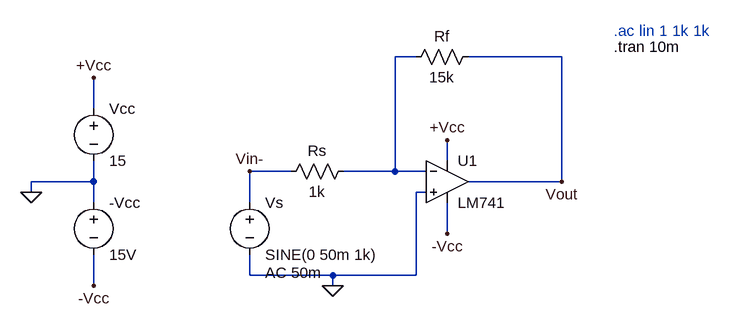
[diagram p0: schematic Inverting Mode.asc]
Inverting Mode.asc, the LTspice schematic file:
Version 4
SHEET 1 880 680
WIRE 144 -48 112 -48
WIRE 368 -48 224 -48
WIRE -352 32 -352 -16
WIRE 192 112 192 80
WIRE -48 128 -112 128
WIRE 112 128 112 -48
WIRE 112 128 32 128
WIRE 160 128 112 128
WIRE -352 144 -352 112
WIRE -352 144 -448 144
WIRE 368 144 368 -48
WIRE 368 144 224 144
WIRE -448 160 -448 144
WIRE 160 160 144 160
WIRE -352 176 -352 144
WIRE -112 176 -112 128
WIRE 192 224 192 176
WIRE -112 288 -112 256
WIRE 16 288 -112 288
WIRE 144 288 144 160
WIRE 144 288 16 288
WIRE -352 304 -352 256
WIRE 16 304 16 288
FLAG -448 160 0
FLAG -352 -16 +Vcc
FLAG 192 80 +Vcc
FLAG -352 304 -Vcc
FLAG 192 224 -Vcc
FLAG 16 304 0
FLAG 368 144 Vout
FLAG -112 128 Vin-
SYMBOL Opamps\\LM741 192 80 R0
SYMATTR InstName U1
SYMBOL res 240 -64 R90
WINDOW 0 0 56 VBottom 2
WINDOW 3 32 56 VTop 2
SYMATTR InstName Rf
SYMATTR Value 15k
SYMBOL res 48 112 R90
WINDOW 0 0 56 VBottom 2
WINDOW 3 32 56 VTop 2
SYMATTR InstName Rs
SYMATTR Value 1k
SYMBOL voltage -112 160 R0
WINDOW 123 24 124 Left 2
WINDOW 39 0 0 Left 0
SYMATTR Value2 AC 50m
SYMATTR InstName Vs
SYMATTR Value SINE(0 50m 1k)
SYMBOL voltage -352 16 R0
WINDOW 123 0 0 Left 0
WINDOW 39 0 0 Left 0
SYMATTR InstName Vcc
SYMATTR Value 15
SYMBOL voltage -352 160 R0
WINDOW 123 0 0 Left 0
WINDOW 39 0 0 Left 0
SYMATTR InstName -Vcc
SYMATTR Value 15V
TEXT 448 -88 Left 2 ;.ac lin 1 1k 1k
TEXT 448 -64 Left 2 !.tran 10m

The netlist it stands for:
* Inverting Mode.asc
XU1 0 N001 +Vcc -Vcc Vout LM741  ; pins In+ In- V+ V- OUT
Rf Vout N001 15k
Rs N001 Vin- 1k
Vs Vin- 0 SINE(0 50m 1k) AC 50m
Vcc +Vcc 0 15
V§-Vcc 0 -Vcc 15V
* .ac lin 1 1k 1k
.tran 10m
.lib LM741.lib
.backanno
.end